# Altium project Tx_OpAmp.PrjPcb
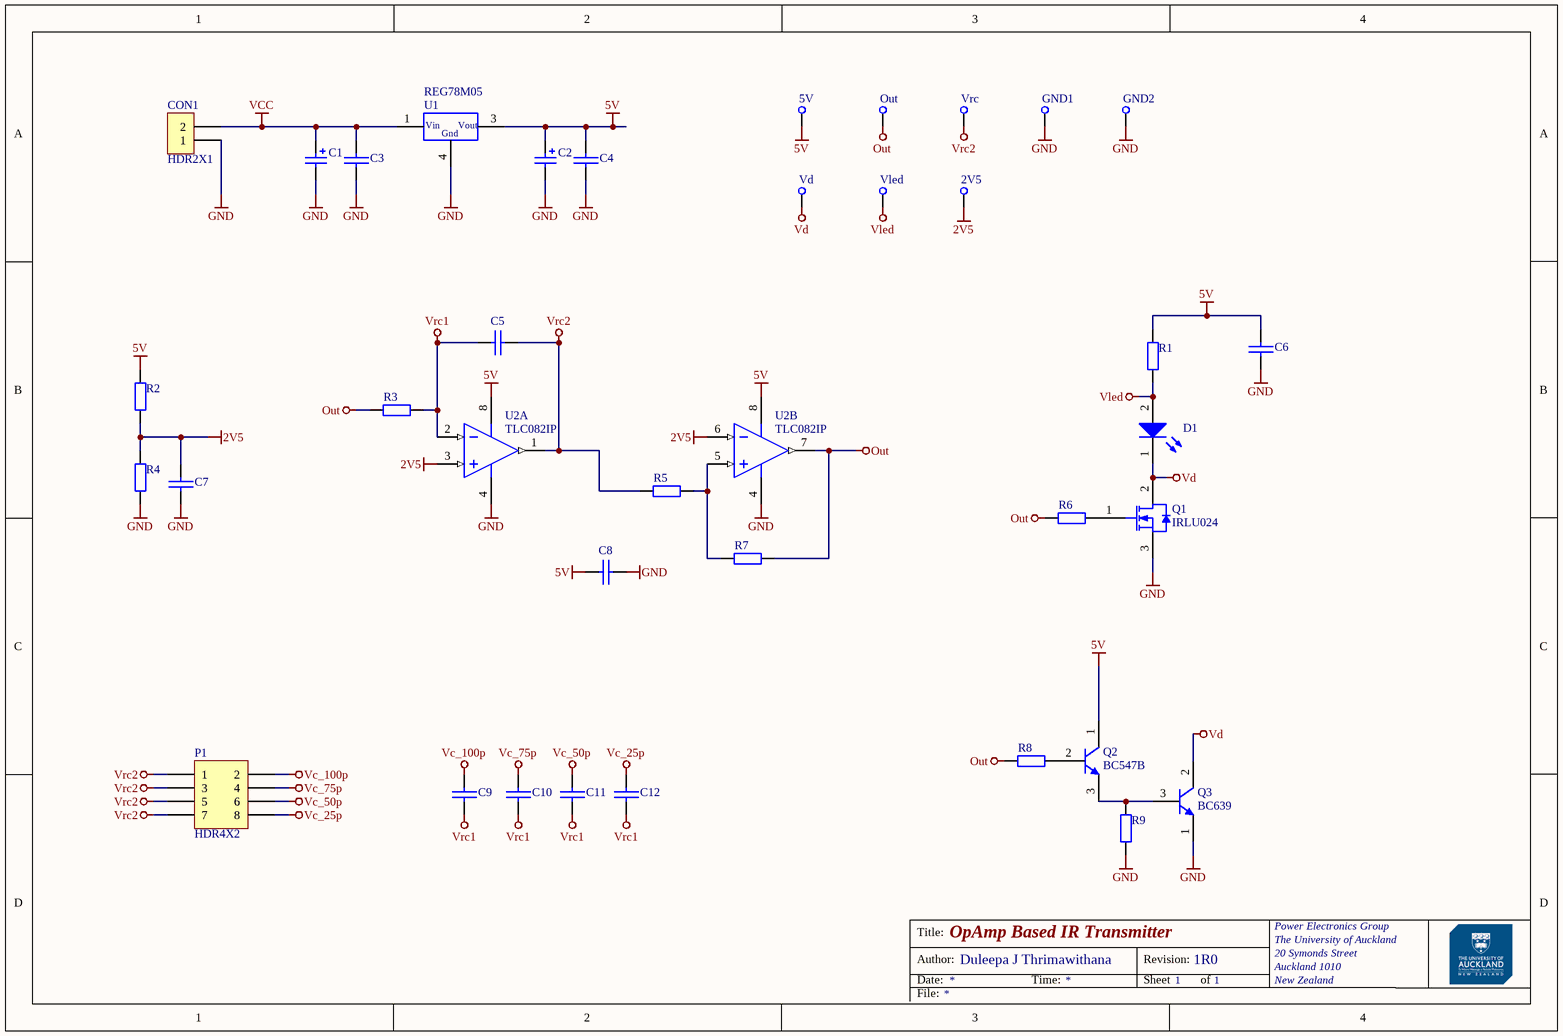
[diagram p0: Tx_OpAmp_Sch.SchDoc]
1 sheet, 37 parts. Net scope: global (net labels, ports and power ports of the same name join across sheets).
Board file: Tx_OpAmp_PCB.PcbDoc

## Sheet Tx_OpAmp_Sch.SchDoc: OpAmp Based IR Transmitter
size A4; Author: Duleepa J Thrimawithana; Organization: Power Electronics Group; Address1: The University of Auckland; Address2: 20 Symonds Street; Address3: Auckland 1010; Address4: New Zealand; Revision: 1R0; SheetNumber: 1; SheetTotal: 1

### Parts
2V5  TP TH  [TP_TH_2.5mm]  (value not drawn)
5V  TP TH  [TP_TH_2.5mm]  (value not drawn)
C1  ECAP  [CR05]  (value not drawn)
C2  ECAP  [CR05]  (value not drawn)
C3  CCAP_TH_5P0  [CCAP_5P0]  (value not drawn)
C4  CCAP_TH_5P0  [CCAP_5P0]  (value not drawn)
C5  CCAP_TH_5P0  [CCAP_5P0]  (value not drawn)
C6  CCAP_TH_5P0  [CCAP_5P0]  (value not drawn)
C7  CCAP_TH_5P0  [CCAP_5P0]  (value not drawn)
C8  CCAP_TH_5P0  [CCAP_5P0]  (value not drawn)
C9  CCAP_TH_5P0  [CCAP_5P0]  (value not drawn)
C10  CCAP_TH_5P0  [CCAP_5P0]  (value not drawn)
C11  CCAP_TH_5P0  [CCAP_5P0]  (value not drawn)
C12  CCAP_TH_5P0  [CCAP_5P0]  (value not drawn)
CON1  HDR2X1  [HDR2X1_2P54]
D1  LED_TH  [TH_LED]  (value not drawn)
GND1  TP TH  [TP_TH_2.5mm]  (value not drawn)
GND2  TP TH  [TP_TH_2.5mm]  (value not drawn)
Out  TP TH  [TP_TH_2.5mm]  (value not drawn)
P1  HDR4X2  [HDR4X2-2P54]
Q1  IRLU024  [FP-PG-TO251-3-MFG]
Q2  BC547B  [ONSC-TO-92-3-29-11]
Q3  BC639  [ONSC-TO-92-3-29-11]
R1  RESAX4  [RAX4]  (value not drawn)
R2  RESAX4  [RAX4]  (value not drawn)
R3  RESAX4  [RAX4]  (value not drawn)
R4  RESAX4  [RAX4]  (value not drawn)
R5  RESAX4  [RAX4]  (value not drawn)
R6  RESAX4  [RAX4]  (value not drawn)
R7  RESAX4  [RAX4]  (value not drawn)
R8  RESAX4  [RAX4]  (value not drawn)
R9  RESAX4  [RAX4]  (value not drawn)
U1  REG78M05  [TO220_Reg]
U2  TLC082IP  [P0008A]  (parts A,B of 2)
Vd  TP TH  [TP_TH_2.5mm]  (value not drawn)
Vled  TP TH  [TP_TH_2.5mm]  (value not drawn)
Vrc  TP TH  [TP_TH_2.5mm]  (value not drawn)

### Nets
2V5: 2V5.1 C7.1 R2.2 R4.1 U2.3(IN1+) U2.6(IN2-)
5V: 5V.1 C2.1 C4.2 C6.2 C8.2 Q2.1(C) R1.2 R2.1 U1.3(Vout) U2.8(VDD)
GND: C1.2 C2.2 C3.1 C4.1 C6.1 C7.2 C8.1 CON1.1 GND1.1 GND2.1 Q1.3(SOURCE) Q3.1(E) R4.2 R9.2 U1.4(Gnd) U2.4(GND)
Out: Out.1 R3.2 R6.2 R7.1 R8.1 U2.7(OUT2)
Vc_25p: C12.2 P1.8
Vc_50p: C11.2 P1.6
Vc_75p: C10.2 P1.4
Vc_100p: C9.2 P1.2
VCC: C1.1 C3.2 CON1.2 U1.1(Vin)
Vd: D1.1(C) Q1.2(DRAIN) Q3.2(C) Vd.1
Vled: D1.2(A) R1.1 Vled.1
Vrc1: C5.2 C9.1 C10.1 C11.1 C12.1 R3.1 U2.2(IN1-)
Vrc2: C5.1 P1.1 P1.3 P1.5 P1.7 R5.2 U2.1(OUT1) Vrc.1
NetQ1_1: Q1.1(GATE) R6.1
NetQ2_2: Q2.2(B) R8.2
NetQ2_3: Q2.3(E) Q3.3(B) R9.1
NetR5_1: R5.1 R7.2 U2.5(IN2+)

### Notes on the sheet
- Title:
- Author:
- Date:
- Time:
- Revision:
- Sheet
- of
- File:

### Library data of the parts
2V5 5V GND1 GND2 Out Vd Vled Vrc = CMP-046-000000-3: Testpoint through hole / Keystone compact / 5000 - Red / 5001 - Black / 5002 - White / 5003 - Orange / 5004 - Yellow; Source: UoAPE_Connectors and Mechanical.SchLib; Design Item ID: TP TH
C1 C2 = CMP-003-000000-2: Source: CommonSymbols_V1.SchLib; Design Item ID: ECAP
C3-C12 = CMP-001-00023-1: TH ceramic cap with 5mm pitch; Design Item ID: CCAP_5P0
CON1 = CMP-004-000000-7: Header 2X1; Design Item ID: HDR2X1; Source: CommonSymbols_V1.SchLib
D1 = CMP-007-00002-1: LED RED TH
P1 = CMP-002-00015-5: Header, 8-Pin, Dual row; Source: CommonSymbols_V1.SchLib; Design Item ID: HDR3X2
Q1 = CMP-013-00004-1: Power Field-Effect Transistor, 80A I(D), 75V, 0.009ohm, 1-Element, N-Channel, Silicon, Metal-oxide Semiconductor FET, TO-251AA; Avalanche Energy Rating (Eas): 120mJ; Power Dissipation-Max (Abs): 140W; Time @ Peak Reflow Temperature-Max (s): 30s; Number of Elements: 1; Operating Mode: ENHANCEMENT MODE; Pulsed Drain Current-Max (IDM): 310A; Drain-source On Resistance-Max: 9mR; Surface Mount: No; Qualification Status: Not Qualified; Transistor Application: SWITCHING; Package Body Material: Plastic; Case Connection: DRAIN; Peak Reflow Temperature (Cel): 260°C; Drain Current-Max (ID): 80A; Max Operating Temperature: 175°C; JESD-30 Code: R-PSIP-T3; Moisture Sensitivity Level: 1; Polarity/Channel Type: N-CHANNEL; Reach SVHC Compliant: Yes; Package Shape: Rectangular; Terminal Finish: Nickel; Transistor Element Material: SILICON; Drain Current-Max (Abs) (ID): 80A; FET Technology: METAL-OXIDE SEMICONDUCTOR; DS Breakdown Voltage-Min: 75V; Pins: 3; Terminal Form: Through Hole; Terminal Position: SINGLE; JESD-609 Code: e3; Package Style: IN-LINEMeter; RoHS Compliant: Yes; JEDEC-95 Code: TO-251AA
Q2 = CMP-013-00006-1: Small Signal Bipolar Transistor, 0.1A I(C), 45V V(BR)CEO, 1-Element, NPN, Silicon, TO-92; RoHS Compliant: Yes
Q3 = CMP-013-00005-1: Small Signal Bipolar Transistor, 1A I(C), 80V V(BR)CEO, 1-Element, NPN, Silicon, TO-92; Time @ Peak Reflow Temperature-Max (s): 30s; Qualification Status: Not Qualified; DC Current Gain-Min (hFE): 40; Power Dissipation-Max (Abs): 800mW; Number of Elements: 1; Package Body Material: Plastic; Frequency: 200MHz; Surface Mount: No; Transistor Element Material: SILICON; Terminal Form: Through Hole; Max Collector Current: 1A; RoHS Compliant: No; Peak Reflow Temperature (Cel): 240°C; JESD-609 Code: e0; Terminal Position: BOTTOM; Package Style: CYLINDRICALMeter; Terminal Finish: Tin; JEDEC-95 Code: TO-92; Max Operating Temperature: 150°C; Collector-emitter Voltage-Max: 80V; JESD-30 Code: O-PBCY-T3; Polarity/Channel Type: NPN; Pins: 3; Package Shape: Round; Reach SVHC Compliant: No
R1-R9 = CMP-010-000001-2: Axial Resistor; Design Item ID: RESAX4; Source: CommonSymbols_V1.SchLib
U1 = CMP-011-000018-2: 78M Series Linear Regulators; Source: CommonSymbols_V1.SchLib; Design Item ID: REG78MXX
U2 = CMP-014-00006-1: Operational Amplifier, 2 Func, 3000uV Offset-Max, BIMOS, PDIP8; Max Supply Current: 7mA; Frequency Compensation: YES; Package Equivalence Code: DIP8,.3; Low-Offset: No; Average Bias Current-Max (IIB): 700pA; Power: 100mW; Supply Voltage Limit-Max: 17V; Package Body Material: Plastic; Common-mode Reject Ratio-Nom: 110dB; Input Offset Voltage-Max: 3mV; Unity Gain BW-Nom: 10MHz; Bias Current-Max (IIB) @25C: 50pA; Slew Rate: 16V/µs; Architecture: VOLTAGE-FEEDBACK; Qualification Status: Not Qualified; Slew Rate-Min: 9.5V/µs; Nominal Supply Voltage: 5V; Voltage Gain-Min: 100000; Channels: 2; Surface Mount: No; Power Supplies: +-2.25/+-8/4.5/16V; Case/Package: DIP; Length: 9.81mm; Terminal Form: Through Hole; Terminal Finish: Nickel; Technology: BIMOS; Low-Bias: Yes; Package Style: IN-LINEMeter; Wideband: No; Height - Seated (Max): 5.08mm; Temperature Grade: AUTOMOTIVE; Terminal Position: DUAL; Packaging: Rail/Tube; JESD-609 Code: e4; Package Shape: Rectangular; Amplifier Type: OPERATIONAL AMPLIFIER; Max Operating Temperature: 125°C; Width: 7.62mm; RoHS Compliant: Yes; Programmable Power: No; Reach SVHC Compliant: Yes; JESD-30 Code: R-PDIP-T8; Terminal Pitch: 2.54mm; Micropower: No; Min Operating Temperature: -40°C; Pins: 8